# Altium project FLYV02.PrjPcb
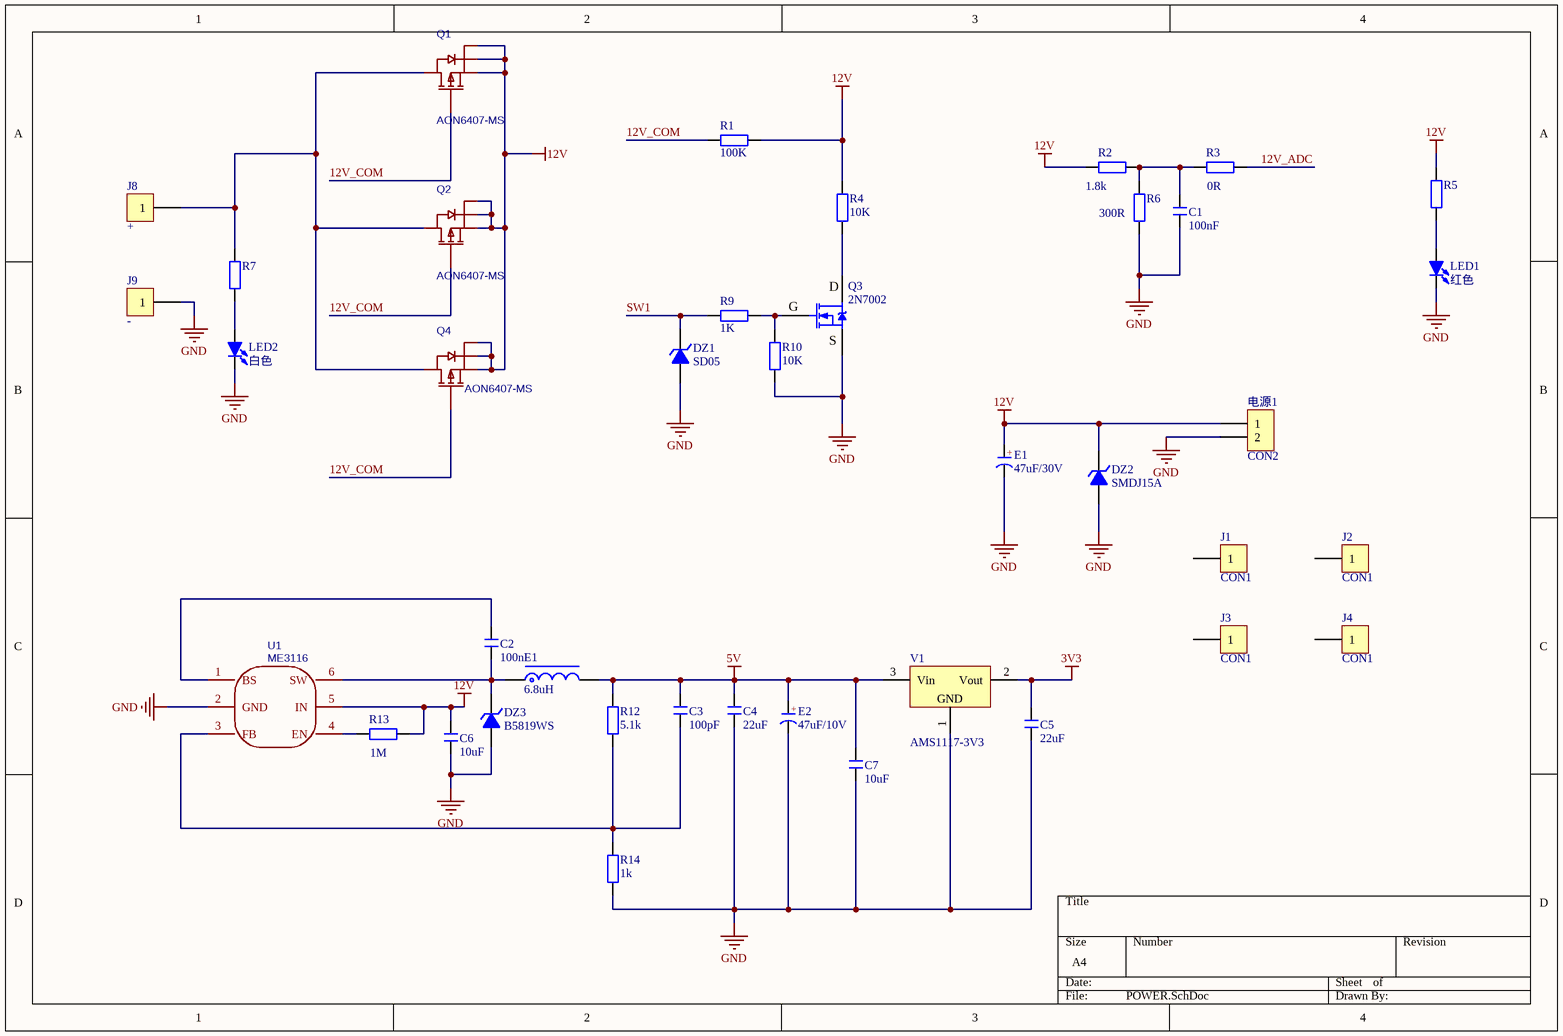
[diagram p0: POWER.SchDoc]
4 sheets, 121 parts. Net scope: global (net labels, ports and power ports of the same name join across sheets).
Board file: FLY_PCB1.PcbDoc
Sheets:
  POWER.SchDoc
  SENSOR.SchDoc
  COMMUNICATION.SchDoc
  MCU.SchDoc

## Sheet POWER.SchDoc
size A4; SheetNumber: 1; SheetTotal: 4

### Parts
C1  100nF  [C 0805_L]
C2  100nF  [C 0805_L]
C3  100pF  [C 0805_L]
C4  22uF  [C 0805_L]
C5  22uF  [C 0805_L]
C6  10uF  [C 0805_L]
C7  10uF  [C 0805_L]
DZ1  SD05  [SOD-323]
DZ2  SMDJ15A  [SMC]
DZ3  B5819WS  [SOD-323]
E1  47uF/30V  [CM D(6.3*7.7)]
E2  47uF/10V  [CM B(4*5.4)]
J1  CON1  [M3x5+6_L]
J2  CON1  [M3x5+6_L]
J3  CON1  [M3x5+6_L]
J4  CON1  [M3x5+6_L]
J8  +  [HDR2.54-LI-1P]
J9  -  [HDR2.54-LI-1P]
L1  6.8uH  [CD42]
LED1  红色  [LED 0805R]
LED2  白色  [LED 0805B]
Q1  AON6407-MS  [TDSON-8_L5.9-W5.2-P1.27-BL]
Q2  AON6407-MS  [TDSON-8_L5.9-W5.2-P1.27-BL]
Q3  2N7002  [SOT-23]
Q4  AON6407-MS  [TDSON-8_L5.9-W5.2-P1.27-BL]
R1  100K  [R 0805_L]
R2  1.8k  [R 0805_L]
R3  0R  [R 0805_L]
R4  10K  [R 0805_L]
R5  (no value)  [R 0805_L]
R6  300R  [R 0805_L]
R7  (no value)  [R 0805_L]
R9  1K  [R 0805_L]
R10  10K  [R 0805_L]
R12  5.1k  [R 0805_L]
R13  1M  [R 0805_L]
R14  1k  [R 0805_L]
U1  ME3116  [SOT23-6]
V1  AMS1117-3V3  [SOT-223]
电源1  CON2  [TX60PW-M20]

### Nets
3V3: C5.2 V1.2(Vout)
5V: C3.2 C4.2 C7.2 E2.1(A) L1.2 R12.2 V1.3(Vin)
12V: C6.2 DZ2.2(K) E1.1(A) Q1.1(S) Q1.2(S) Q1.3(S) Q2.1(S) Q2.2(S) Q2.3(S) Q4.1(S) Q4.2(S) Q4.3(S) R1.1 R2.2 R4.2 R5.1 R13.1 U1.5(IN) 电源1.1
GND: C1.1 C4.1 C5.1 C6.1 C7.1 DZ1.1(A) DZ2.1(A) DZ3.1(A) E1.2(K) E2.2(K) J9.1 LED1.2(K) LED2.2(K) Q3.3(S) R6.2 R10.1 R14.1 U1.2(GND) V1.1(GND) 电源1.2
12V_ADC: R3.2
12V_COM: Q1.4(G) Q2.4(G) Q4.4(G) R1.2
SW1: DZ1.2(K) R9.1
NetC1_2: C1.2 R2.1 R3.1 R6.1
NetC2_1: C2.1 DZ3.2(K) L1.1 U1.6(SW)
NetC2_2: C2.2 U1.1(BS)
NetC3_1: C3.1 R12.1 R14.2 U1.3(FB)
NetJ8_1: J8.1 Q1.5(D) Q2.5(D) Q4.5(D) R7.1
NetLED1_1: LED1.1(A) R5.2
NetLED2_1: LED2.1(A) R7.2
NetQ3_1: Q3.1(G) R9.2 R10.2
NetQ3_2: Q3.2(D) R4.1
NetR13_2: R13.2 U1.4(EN)

Not connected (* = marked no-connect by the designer): J1 1; J2 1; J3 1; J4 1

### Notes on the sheet
- (in symbol C-CS) +

### Library data of the parts
C1-C7 = C: 无极性贴片电容; 版权归属: 源创客; BOM名称: 无极性贴片电容; 学习资源: www.ooocke.com
DZ1 = 1N4106: 单向TVS 5V截止 峰值脉冲电流：17A              C502527; BOM名称: 12V/0.5W稳压管; 版权归属: 源创客; 学习资源: www.ooocke.com
DZ2 = 1N4106: TVS 15V截止 峰值浪涌电流：123A                   C438153; BOM名称: 12V/0.5W稳压管; 版权归属: 源创客; 学习资源: www.ooocke.com
DZ3 = 1N5256: 电压:40V 电流:1A                                C7420331; BOM名称: 30V/0.5W稳压管; 版权归属: 源创客; 学习资源: www.ooocke.com
E1 = C-CS: JVJ50V47M6x8                        47uF ±20% 50V                            C46550421; BOM名称: 直插固态电容; 版权归属: 源创客; 学习资源: www.ooocke.com
E2 = C-CS: 47uF ±20% 10V                           C48970978; BOM名称: 直插固态电容; 版权归属: 源创客; 学习资源: www.ooocke.com
J8 J9 = CON1
L1 = L-CD: YP0402-6R8M                          C576569; BOM名称: 功率电感; 版权归属: 源创客; 学习资源: www.ooocke.com
LED1 LED2 = LED-SMD: 贴片LED; 版权归属: 源创客; BOM名称: 贴片LED; 学习资源: www.ooocke.com
Q1 Q2 Q4 = AON6407-MS: Manufacturer: MSKSEMI(美森科); Contributor: lcsc; Supplier: LCSC; Supplier Part: C17702953; Manufacturer Part: AON6407-MS; JLCPCB Part Class: Extended Part; spicePre: Q; spiceSymbolName: AON6407-MS
Q3 = IRF840: N沟场效应管; pin to pad: 2>3 3>2; 版权归属: 源创客; BOM名称: N沟场效应管; 学习资源: www.ooocke.com
R1-R7 R9 R10 R12-R14 = R: 贴片电阻; 版权归属: 源创客; BOM名称: 贴片电阻; 学习资源: www.ooocke.com
U1 = ME3116: ME3116AM6G / ME3116是一款内部集成了MOSFET的异步整流降压型稳压器,能够在4.75V至40V的输入电压范围内提供高达1A的负载能力。采用PWM控制模式,具有良好的瞬态响应和逐周期限流功能。在轻载条件下自动切换到PFM模式,保证较高的轻载效率。内置软启动和环路补偿,具有过热关断、输入欠压保护、BS欠压保护和短路保护。; Manufacturer: MICRONE(南京微盟); Supplier: LCSC; Manufacturer Part: ME3116AM6G; Supplier Part: C97643; JLCPCB Part Class: Extended Part; spicePre: U; spiceSymbolName: ME3116
V1 = AMS1117: 三端稳压芯片; BOM名称: 稳压芯片; 版权归属: 源创客; 学习资源: www.ooocke.com
电源1 = CON2: Connector

## Sheet SENSOR.SchDoc
size A4; SheetNumber: 2; SheetTotal: 4
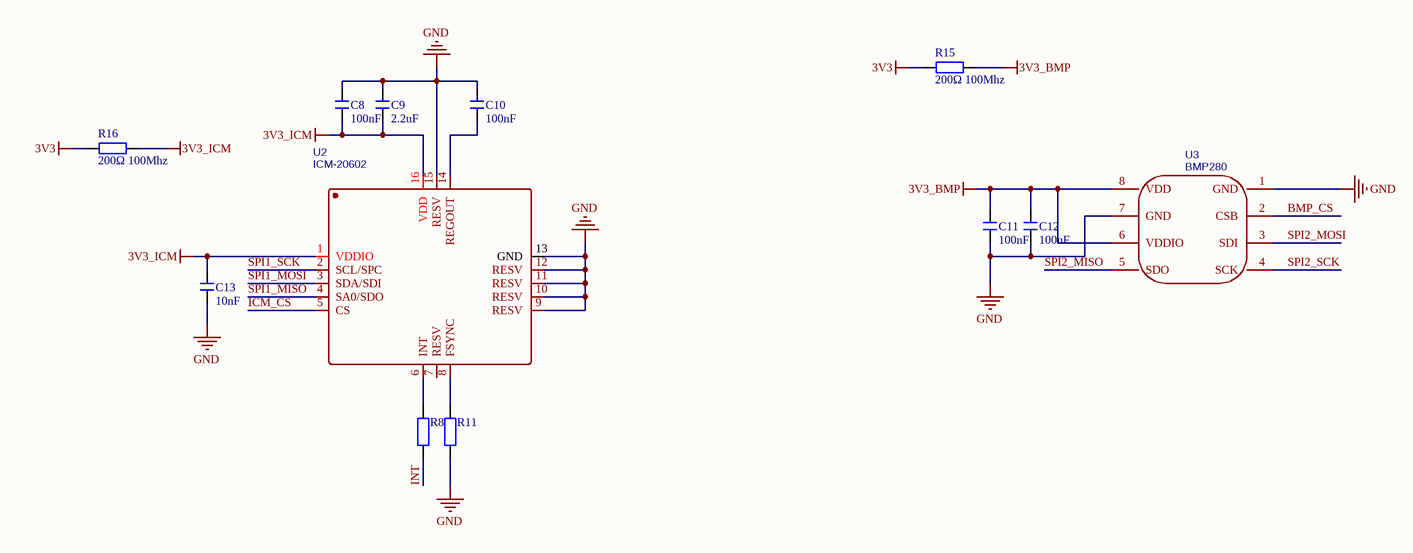
[diagram p1: SENSOR.SchDoc]

### Parts
C8  100nF  [C 0603_L]
C9  2.2uF  [C 0603_L]
C10  100nF  [C 0603_L]
C11  100nF  [C 0603_L]
C12  100nF  [C 0603_L]
C13  10nF  [C 0603_L]
R8  (no value)  [R 0603_L]
R11  (no value)  [R 0603_L]
R15  200Ω 100Mhz  [R 0805_L]
R16  200Ω 100Mhz  [R 0805_L]
U2  ICM-20602  [LGA-16_L3.0-W3.0-P0.50-BL]
U3  BMP280  [LGA-8_L2.5-W2.0-P0.65_AMP6127]

### Nets
3V3: R15.1 R16.1
3V3_BMP: C11.1 C12.1 R15.2 U3.6(VDDIO) U3.8(VDD)
3V3_ICM: C8.2 C9.2 C13.2 R16.2 U2.1(VDDIO) U2.16(VDD)
GND: C8.1 C9.1 C10.1 C11.2 C12.2 C13.1 R11.2 U2.9(RESV) U2.10(RESV) U2.11(RESV) U2.12(RESV) U2.13(GND) U2.15(RESV) U3.1(GND) U3.7(GND)
BMP_CS: U3.2(CSB)
ICM_CS: U2.5(CS)
INT: R8.2
SPI1_MISO: U2.4(SA0/SDO)
SPI1_MOSI: U2.3(SDA/SDI)
SPI1_SCK: U2.2(SCL/SPC)
SPI2_MISO: U3.5(SDO)
SPI2_MOSI: U3.3(SDI)
SPI2_SCK: U3.4(SCK)
NetC10_2: C10.2 U2.14(REGOUT)
NetR8_1: R8.1 U2.6(INT)
NetR11_1: R11.1 U2.8(FSYNC)

Not connected (* = marked no-connect by the designer): U2 7(RESV)

### Library data of the parts
C8-C13 = C: 无极性贴片电容; 版权归属: 源创客; BOM名称: 无极性贴片电容; 学习资源: www.ooocke.com
R8 R11 = R: 贴片电阻; 版权归属: 源创客; BOM名称: 贴片电阻; 学习资源: www.ooocke.com
R15 R16 = R: 磁珠; BOM名称: 贴片电阻; 版权归属: 源创客; 学习资源: www.ooocke.com
U2 = ICM-20602: 六轴MEMS运动跟踪设备; Manufacturer: TDK InvenSense(应美盛); Contributor: LCSC; Supplier: LCSC; Supplier Part: C97633; Manufacturer Part: ICM-20602; JLCPCB Part Class: Extended Part; link: https://so.szlcsc.com/global.html?k=C97633&ref=editor; spicePre: U; spiceSymbolName: ICM-20602
U3 = BMP280: Manufacturer: Bosch(博世); Supplier: LCSC; Manufacturer Part: BMP280; Supplier Part: C83291; JLCPCB Part Class: Extended Part; spicePre: U; spiceSymbolName: BMP280

## Sheet COMMUNICATION.SchDoc
size A4; SheetNumber: 3; SheetTotal: 4
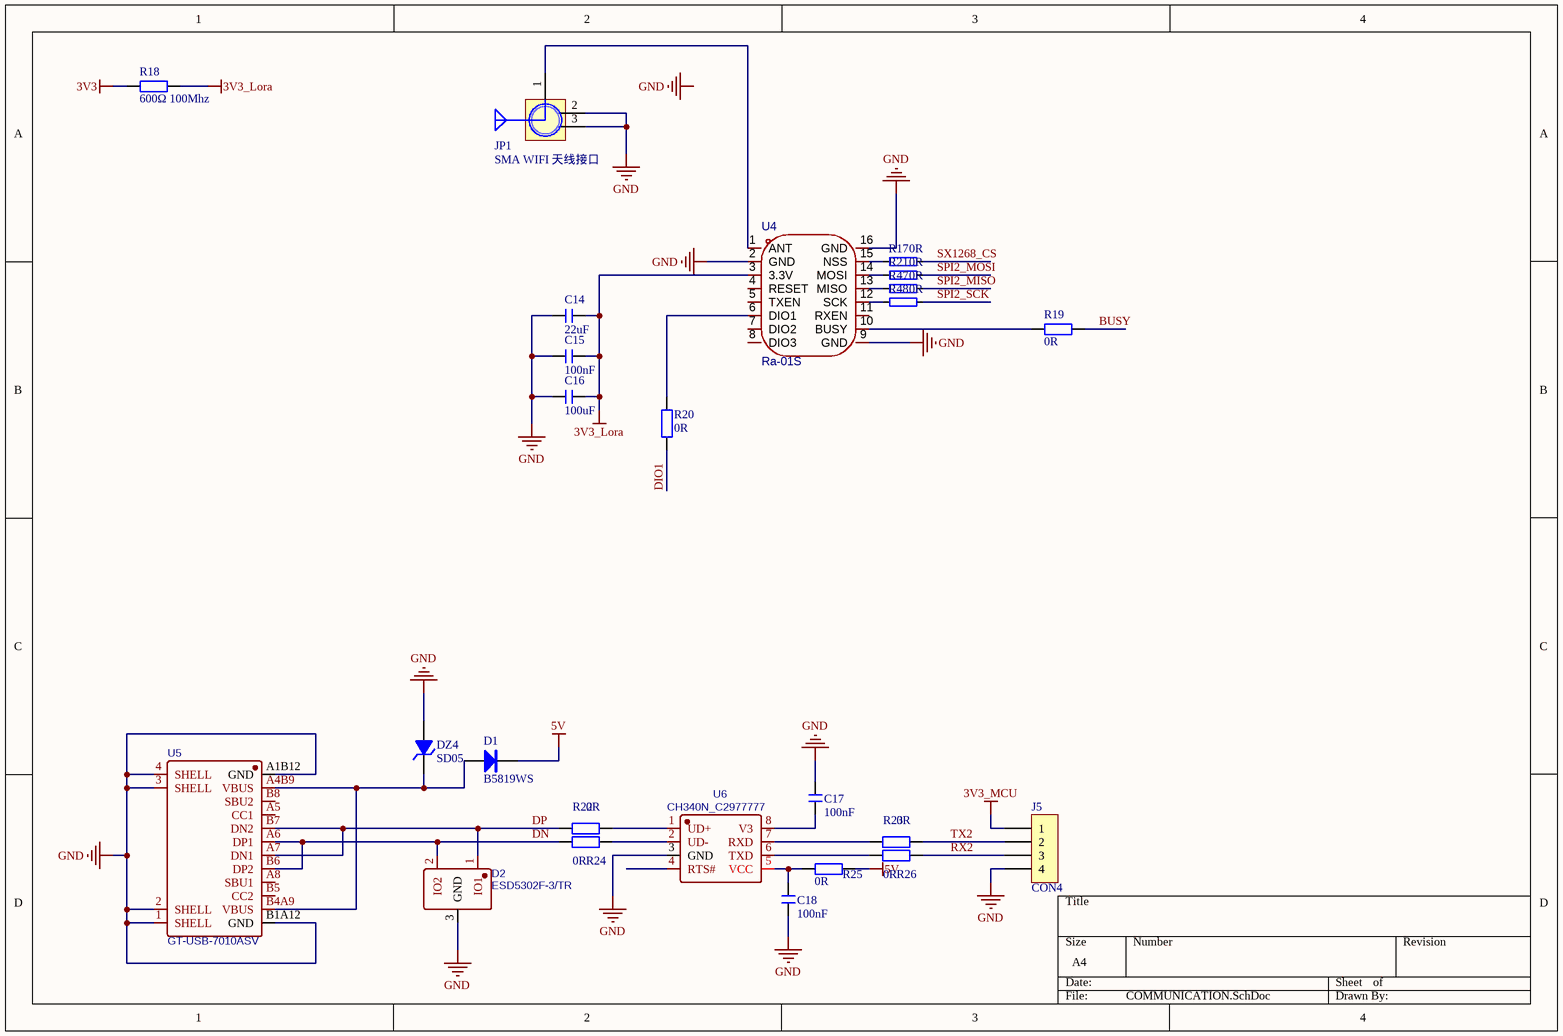
[diagram p2: COMMUNICATION.SchDoc]

### Parts
C14  22uF  [C 0805_L]
C15  100nF  [C 0603_L]
C16  100uF  [C 0603_L]
C17  100nF  [C 0603_L]
C18  100nF  [C 0603_L]
D1  B5819WS  [SOD-323]
D2  ESD5302F-3/TR  [SOT-23]
DZ4  SD05  [SOD-323]
J5  CON4  [HDR2.54-LI-4P]
JP1  SMA WIFI 天线接口  [SMA-KE]
R17  0R  [R 0603_L]
R18  600Ω 100Mhz  [R 0805_L]
R19  0R  [R 0603_L]
R20  0R  [R 0603_L]
R21  0R  [R 0603_L]
R22  0R  [R 0603_L]
R23  0R  [R 0603_L]
R24  0R  [R 0603_L]
R25  0R  [R 0603_L]
R26  0R  [R 0603_L]
R47  0R  [R 0603_L]
R48  0R  [R 0603_L]
U4  Ra-01S  [RA-01SCH-P-TJFZ]
U5  GT-USB-7010ASV  [USB-C-SMD_G-SWITCH_GT-USB-7010ASV]
U6  CH340N_C2977777  [SOP8]

### Nets
3V3: R18.1
3V3_Lora: C14.2 C15.2 C16.2 R18.2 U4.3(3.3V)
3V3_MCU: J5.1
5V: D1.2(K) R25.2
GND: C14.1 C15.1 C16.1 C17.1 C18.2 D2.3(GND) DZ4.1(A) J5.4 JP1.2(GND) JP1.3(GND) U4.2(GND) U4.9(GND) U4.16(GND) U5.1(SHELL) U5.2(SHELL) U5.3(SHELL) U5.4(SHELL) U5.A1B12(GND) U5.B1A12(GND) U6.3(GND)
BUSY: R19.1
DIO1: R20.1
DN: D2.2(IO2) R24.1 U5.A6(DP1) U5.B6(DP2)
DP: D2.1(IO1) R22.1 U5.A7(DN1) U5.B7(DN2)
RX2: J5.3 R26.2
SPI2_MISO: R47.1
SPI2_MOSI: R21.1
SPI2_SCK: R48.1
SX1268_CS: R17.1
TX2: J5.2 R23.2
NetC17_2: C17.2 U6.8(V3)
NetC18_1: C18.1 R25.1 U6.5(VCC)
NetD1_1: D1.1(A) DZ4.2(K) U5.A4B9(VBUS) U5.B4A9(VBUS)
NetJP1_1: JP1.1(ANT) U4.1(ANT)
NetR17_2: R17.2 U4.15(NSS)
NetR19_2: R19.2 U4.10(BUSY)
NetR20_2: R20.2 U4.6(DIO1)
NetR21_2: R21.2 U4.14(MOSI)
NetR22_2: R22.2 U6.1(UD+)
NetR23_1: R23.1 U6.7(RXD)
NetR24_2: R24.2 U6.2(UD-)
NetR26_1: R26.1 U6.6(TXD)
NetR47_2: R47.2 U4.13(MISO)
NetR48_2: R48.2 U4.12(SCK)

Not connected (* = marked no-connect by the designer): U4 4(RESET) 5(TXEN) 7(DIO2) 8(DIO3) 11(RXEN); U5 A5(CC1) A8(SBU1) B5(CC2) B8(SBU2); U6 4(RTS#)

### Notes on the sheet
- Labels drawn without touching a wire or pin: GND

### Library data of the parts
C14-C18 = C: 无极性贴片电容; 版权归属: 源创客; BOM名称: 无极性贴片电容; 学习资源: www.ooocke.com
D1 = SR540: 肖特基二极管                           电压:40V 电流:1A                 C7420331; BOM名称: 整流二极管; 版权归属: 源创客; 属性: 40V  5A; 学习资源: www.ooocke.com
D2 = ESD5302F-3/TR: 单向TVS 5V截止 峰值浪涌电流：4A@8/20us                        C239643; Manufacturer: WILLSEMI(韦尔); Contributor: LCSC; Supplier: LCSC; Supplier Part: C239643; Manufacturer Part: ESD5302F-3/TR; JLCPCB Part Class: Extended Part; spicePre: D; spiceSymbolName: ESD5302F-3/TR
DZ4 = 1N4106: as DZ1 on sheet POWER; 学习资源: www.ooocke.com
J5 = CON4: Connector
JP1 = SMA: SMA-2.4G射频天线接口; 版权归属: 源创客; BOM名称: SMA-2.4G射频天线接口; 学习资源: www.ooocke.com
R17 R21 R47 R48 = 普通电阻
R18 = R: 磁珠; BOM名称: 贴片电阻; 版权归属: 源创客; 学习资源: www.ooocke.com
R19 R20 R22-R26 = R: 贴片电阻; 版权归属: 源创客; BOM名称: 贴片电阻; 学习资源: www.ooocke.com
U4 = Ra-01S: 发射功率:22dBm;接口类型:SPI;接收灵敏度:-140dBm;; Manufacturer: Ai-Thinker(安信可); AddInBom: yes; ModelId: bfb9ea955ff445c193018999188b6f80聨0819f05c4eef4c71ace90d822a990e87; ModelName: COMM-SMD_L17.0-W16.0-H3.2-RA-01S; ModelTransform: 629.92,669.29,0,0,0,0,0.001,0,0; Output Power: 22dBm; Interface Type: SPI; Modulation System: LoRa；OOK；MSK；GFSK；FSK；GMSK; Voltage - Supply: 3.3V; Antenna Type: IPEX接口; Receive  Current: 4.5mA; Send  Current: 140mA; Symbol: RA-01S; Device: Ra-01S; LCSC Part Name: 两件套 LoRa 系列模块 两件套; SupplierPart: C724871; ManufacturerPart: Ra-01S; Supplier Footprint: SMD,17x16mm; JLCPCB Part Class: Extended Part; Datasheet: https://item.szlcsc.com/datasheet/Ra-01S/770920.html; Supplier: LCSC; ConvertToPcb: yes; FootprintName: COMM-SMD_RA-01S; Sensitivity: -140dBm; Operating Temperature: -40℃~+85℃
U5 = GT-USB-7010ASV: Type-C 母 卧贴                板上16pin，有柱无弹，L7.35 CH1.68mm，3A电流                         C2988369; Manufacturer: G-Switch(品赞); Contributor: lcsc; Supplier: LCSC; Supplier Part: C2988369; Manufacturer Part: GT-USB-7010ASV; JLCPCB Part Class: Extended Part; spicePre: U; spiceSymbolName: GT-USB-7010ASV
U6 = CH340N_C2977777: Manufacturer: WCH(南京沁恒); Manufacturer Part: CH340N; Contributor: LCSC; Supplier: LCSC; Supplier Part: C2977777; JLCPCB Part Class: Extended Part; spicePre: U; spiceSymbolName: CH340N_C2977777

## Sheet MCU.SchDoc
size A4; SheetNumber: 4; SheetTotal: 4
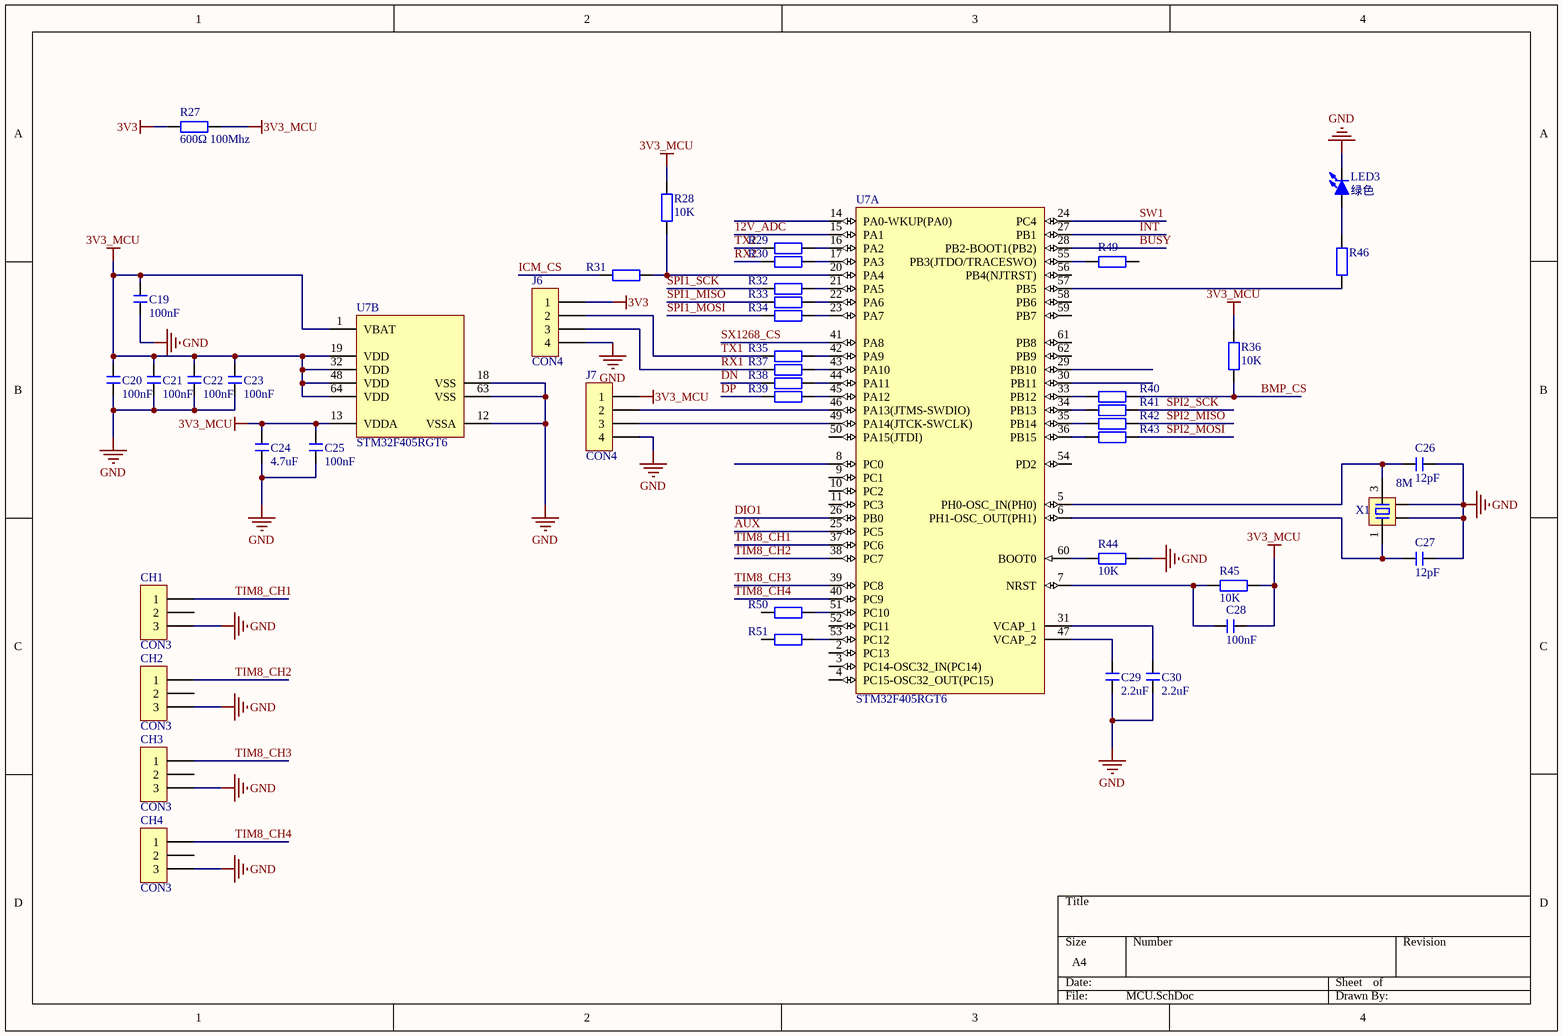
[diagram p3: MCU.SchDoc]

### Parts
C19  100nF  [C 0603_L]
C20  100nF  [C 0603_L]
C21  100nF  [C 0603_L]
C22  100nF  [C 0603_L]
C23  100nF  [C 0603_L]
C24  4.7uF  [C 0603_L]
C25  100nF  [C 0603_L]
C26  12pF  [C 0603_L]
C27  12pF  [C 0603_L]
C28  100nF  [C 0603_L]
C29  2.2uF  [C 0603_L]
C30  2.2uF  [C 0603_L]
CH1  CON3  [HDR2.54-LI-3P]
CH2  CON3  [HDR2.54-LI-3P]
CH3  CON3  [HDR2.54-LI-3P]
CH4  CON3  [HDR2.54-LI-3P]
J6  CON4  [HDR2.54-LI-4P]
J7  CON4  [HDR2.54-LI-4P]
LED3  绿色  [LED 0805G]
R27  600Ω 100Mhz  [R 0805_L]
R28  10K  [R 0603_L]
R29  (no value)  [R 0603_L]
R30  (no value)  [R 0603_L]
R31  (no value)  [R 0603_L]
R32  (no value)  [R 0603_L]
R33  (no value)  [R 0603_L]
R34  (no value)  [R 0603_L]
R35  (no value)  [R 0603_L]
R36  10K  [R 0603_L]
R37  (no value)  [R 0603_L]
R38  (no value)  [R 0603_L]
R39  (no value)  [R 0603_L]
R40  (no value)  [R 0603_L]
R41  (no value)  [R 0603_L]
R42  (no value)  [R 0603_L]
R43  (no value)  [R 0603_L]
R44  10K  [R 0603_L]
R45  10K  [R 0603_L]
R46  (no value)  [R 0603_L]
R49  (no value)  [R 0603_L]
R50  (no value)  [R 0603_L]
R51  (no value)  [R 0603_L]
U7  STM32F405RGT6  [STM-LQFP64_N]  (parts A,B of 2)
X1  8M  [OSC 3225-4P]

### Nets
3V3: J6.1 R27.1
3V3_MCU: C19.2 C20.2 C21.2 C22.2 C23.2 C24.2 C25.2 C28.1 J7.1 R27.2 R28.2 R36.2 R45.2 U7.1(VBAT) U7.13(VDDA) U7.19(VDD) U7.32(VDD) U7.48(VDD) U7.64(VDD)
GND: C19.1 C20.1 C21.1 C22.1 C23.1 C24.1 C25.1 C26.1 C27.1 C29.1 C30.1 CH1.3 CH2.3 CH3.3 CH4.3 J6.4 J7.4 LED3.2(K) R44.2 U7.12(VSSA) U7.18(VSS) U7.63(VSS) X1.2 X1.4
12V_ADC: U7.15(PA1)
AUX: U7.25(PC5)
BMP_CS: R36.1 R40.2
BUSY: U7.28(PB2-BOOT1(PB2))
DIO1: U7.26(PB0)
DN: R38.2
DP: R39.2
ICM_CS: R31.2
INT: U7.27(PB1)
RX1: J6.3 R37.2
RX2: R30.2
SPI1_MISO: R33.2
SPI1_MOSI: R34.2
SPI1_SCK: R32.2
SPI2_MISO: R42.2
SPI2_MOSI: R43.2
SPI2_SCK: R41.2
SW1: U7.24(PC4)
SX1268_CS: U7.41(PA8)
TIM8_CH1: CH1.1 U7.37(PC6)
TIM8_CH2: CH2.1 U7.38(PC7)
TIM8_CH3: CH3.1 U7.39(PC8)
TIM8_CH4: CH4.1 U7.40(PC9)
TX1: J6.2 R35.2
TX2: R29.2
NetC26_2: C26.2 U7.5(PH0-OSC_IN(PH0)) X1.3
NetC27_2: C27.2 U7.6(PH1-OSC_OUT(PH1)) X1.1
NetC28_2: C28.2 R45.1 U7.7(NRST)
NetC29_2: C29.2 U7.47(VCAP_2)
NetC30_2: C30.2 U7.31(VCAP_1)
NetJ7_2: J7.2 U7.46(PA13(JTMS-SWDIO))
NetJ7_3: J7.3 U7.49(PA14(JTCK-SWCLK))
NetLED3_1: LED3.1(A) R46.2
NetR28_1: R28.1 R31.1 U7.20(PA4)
NetR29_1: R29.1 U7.16(PA2)
NetR30_1: R30.1 U7.17(PA3)
NetR32_1: R32.1 U7.21(PA5)
NetR33_1: R33.1 U7.22(PA6)
NetR34_1: R34.1 U7.23(PA7)
NetR35_1: R35.1 U7.42(PA9)
NetR37_1: R37.1 U7.43(PA10)
NetR38_1: R38.1 U7.44(PA11)
NetR39_1: R39.1 U7.45(PA12)
NetR40_1: R40.1 U7.33(PB12)
NetR41_1: R41.1 U7.34(PB13)
NetR42_1: R42.1 U7.35(PB14)
NetR43_1: R43.1 U7.36(PB15)
NetR44_1: R44.1 U7.60(BOOT0)
NetR46_1: R46.1 U7.57(PB5)
NetR49_1: R49.1 U7.55(PB3(JTDO/TRACESWO))
NetR50_1: R50.1 U7.51(PC10)
NetR51_1: R51.1 U7.53(PC12)

Not connected (* = marked no-connect by the designer): CH1 2; CH2 2; CH3 2; CH4 2; R49 2; R50 2; R51 2; U7 2(PC13) 3(PC14-OSC32_IN(PC14)) 4(PC15-OSC32_OUT(PC15)) 8(PC0) 9(PC1) 10(PC2) 11(PC3) 14(PA0-WKUP(PA0)) 29(PB10) 30(PB11) 50(PA15(JTDI)) 52(PC11) 54(PD2) 56(PB4(NJTRST)) 58(PB6) 59(PB7) 61(PB8) 62(PB9)

### Library data of the parts
C19-C30 = C: 无极性贴片电容; 版权归属: 源创客; BOM名称: 无极性贴片电容; 学习资源: www.ooocke.com
CH1-CH4 = CON3: Connector
J6 J7 = CON4: Connector
LED3 = LED-SMD: 贴片LED; 版权归属: 源创客; BOM名称: 贴片LED; 学习资源: www.ooocke.com
R27 = R: 磁珠; BOM名称: 贴片电阻; 版权归属: 源创客; 学习资源: www.ooocke.com
R28-R46 R49-R51 = R: 贴片电阻; 版权归属: 源创客; BOM名称: 贴片电阻; 学习资源: www.ooocke.com
U7 = STM32F405RGT6: ARM Cortex-M4 32-bit MCU+FPU, 210 DMIPS, 1024 kB Flash, 192 kB Internal RAM, 51 I/Os, 64-pin LQFP, -40 to 85 degC, Tray; Manufacturer: STMicroelectronics; D/A Converter: 2x12-bit; FLASH Size (Prog) (kB): 1024; I/Os (High Current): 51; Internal RAM Size (kB): 192; Operating Frequency(F) (Processor speed) (MHz): 168; Supply Voltage(Vcc) max (V): 3.6; Supply Voltage(Vcc) min (V): 1.8; DatasheetVersion: Rev. 4; PackageVersion: Rev. 4, 06/2013; PackageReference: LQFP64; PackageDescription: 64-Pin Low Profile Quad Flat Package, 10 x 10 mm Body, 0.5 mm Pitch; Supplier 1: Digi-Key; Supplier Part Number 1: 497-11767-ND; Supplier 2: Farnell; Supplier Part Number 2: 2064363; Supplier 3: Newark; Supplier Part Number 3: 73T2329; Supplier 4: Mouser; Supplier Part Number 4: 511-STM32F405RGT6; Core: ARM Cortex-M4; Packing: Tray; Mounting Technology: Surface Mount; PartNumber: STM32F405RGT6; ComponentLink1Description: Manufacturer URL; ComponentLink1URL: http://www.st.com/web/en/home.html; ComponentLink2Description: Datasheet; ComponentLink2URL: http://www.st.com/st-web-ui/static/active/en/resource/technical/document/datasheet/DM00037051.pdf; ComponentLink3Description: Package Specification; ComponentLink3URL: http://www.st.com/st-web-ui/static/active/en/resource/technical/document/datasheet/DM00037051.pdf
X1 = XTAL-4P: X32258MOB4SI                        全国产 贴片金属 频点：8MHZ 负载：12PF 常温频差：±10PPM 工作温度：-40~85℃ 型号升级变更为：XL2EL89COI-111YLC-8M                                              C2682775; BOM名称: 4脚无源晶振; 版权归属: 源创客; 学习资源: www.ooocke.com

## Nets that join several sheets
3V3: POWER (C5.2 V1.2), SENSOR (R15.1 R16.1), COMMUNICATION (R18.1), MCU (J6.1 R27.1)
3V3_MCU: COMMUNICATION (J5.1), MCU (19 pins)
5V: POWER (7 pins), COMMUNICATION (D1.2 R25.2)
GND: POWER (20 pins), SENSOR (15 pins), COMMUNICATION (20 pins), MCU (24 pins)
12V_ADC: POWER (R3.2), MCU (U7.15)
BMP_CS: SENSOR (U3.2), MCU (R36.1 R40.2)
BUSY: COMMUNICATION (R19.1), MCU (U7.28)
DIO1: COMMUNICATION (R20.1), MCU (U7.26)
DN: COMMUNICATION (D2.2 R24.1 U5.A6 U5.B6), MCU (R38.2)
DP: COMMUNICATION (D2.1 R22.1 U5.A7 U5.B7), MCU (R39.2)
ICM_CS: SENSOR (U2.5), MCU (R31.2)
INT: SENSOR (R8.2), MCU (U7.27)
RX2: COMMUNICATION (J5.3 R26.2), MCU (R30.2)
SPI1_MISO: SENSOR (U2.4), MCU (R33.2)
SPI1_MOSI: SENSOR (U2.3), MCU (R34.2)
SPI1_SCK: SENSOR (U2.2), MCU (R32.2)
SPI2_MISO: SENSOR (U3.5), COMMUNICATION (R47.1), MCU (R42.2)
SPI2_MOSI: SENSOR (U3.3), COMMUNICATION (R21.1), MCU (R43.2)
SPI2_SCK: SENSOR (U3.4), COMMUNICATION (R48.1), MCU (R41.2)
SW1: POWER (DZ1.2 R9.1), MCU (U7.24)
SX1268_CS: COMMUNICATION (R17.1), MCU (U7.41)
TX2: COMMUNICATION (J5.2 R23.2), MCU (R29.2)